# EAGLE design opac_c1 (EAGLE 6.3)

## Sheet 1 of 2
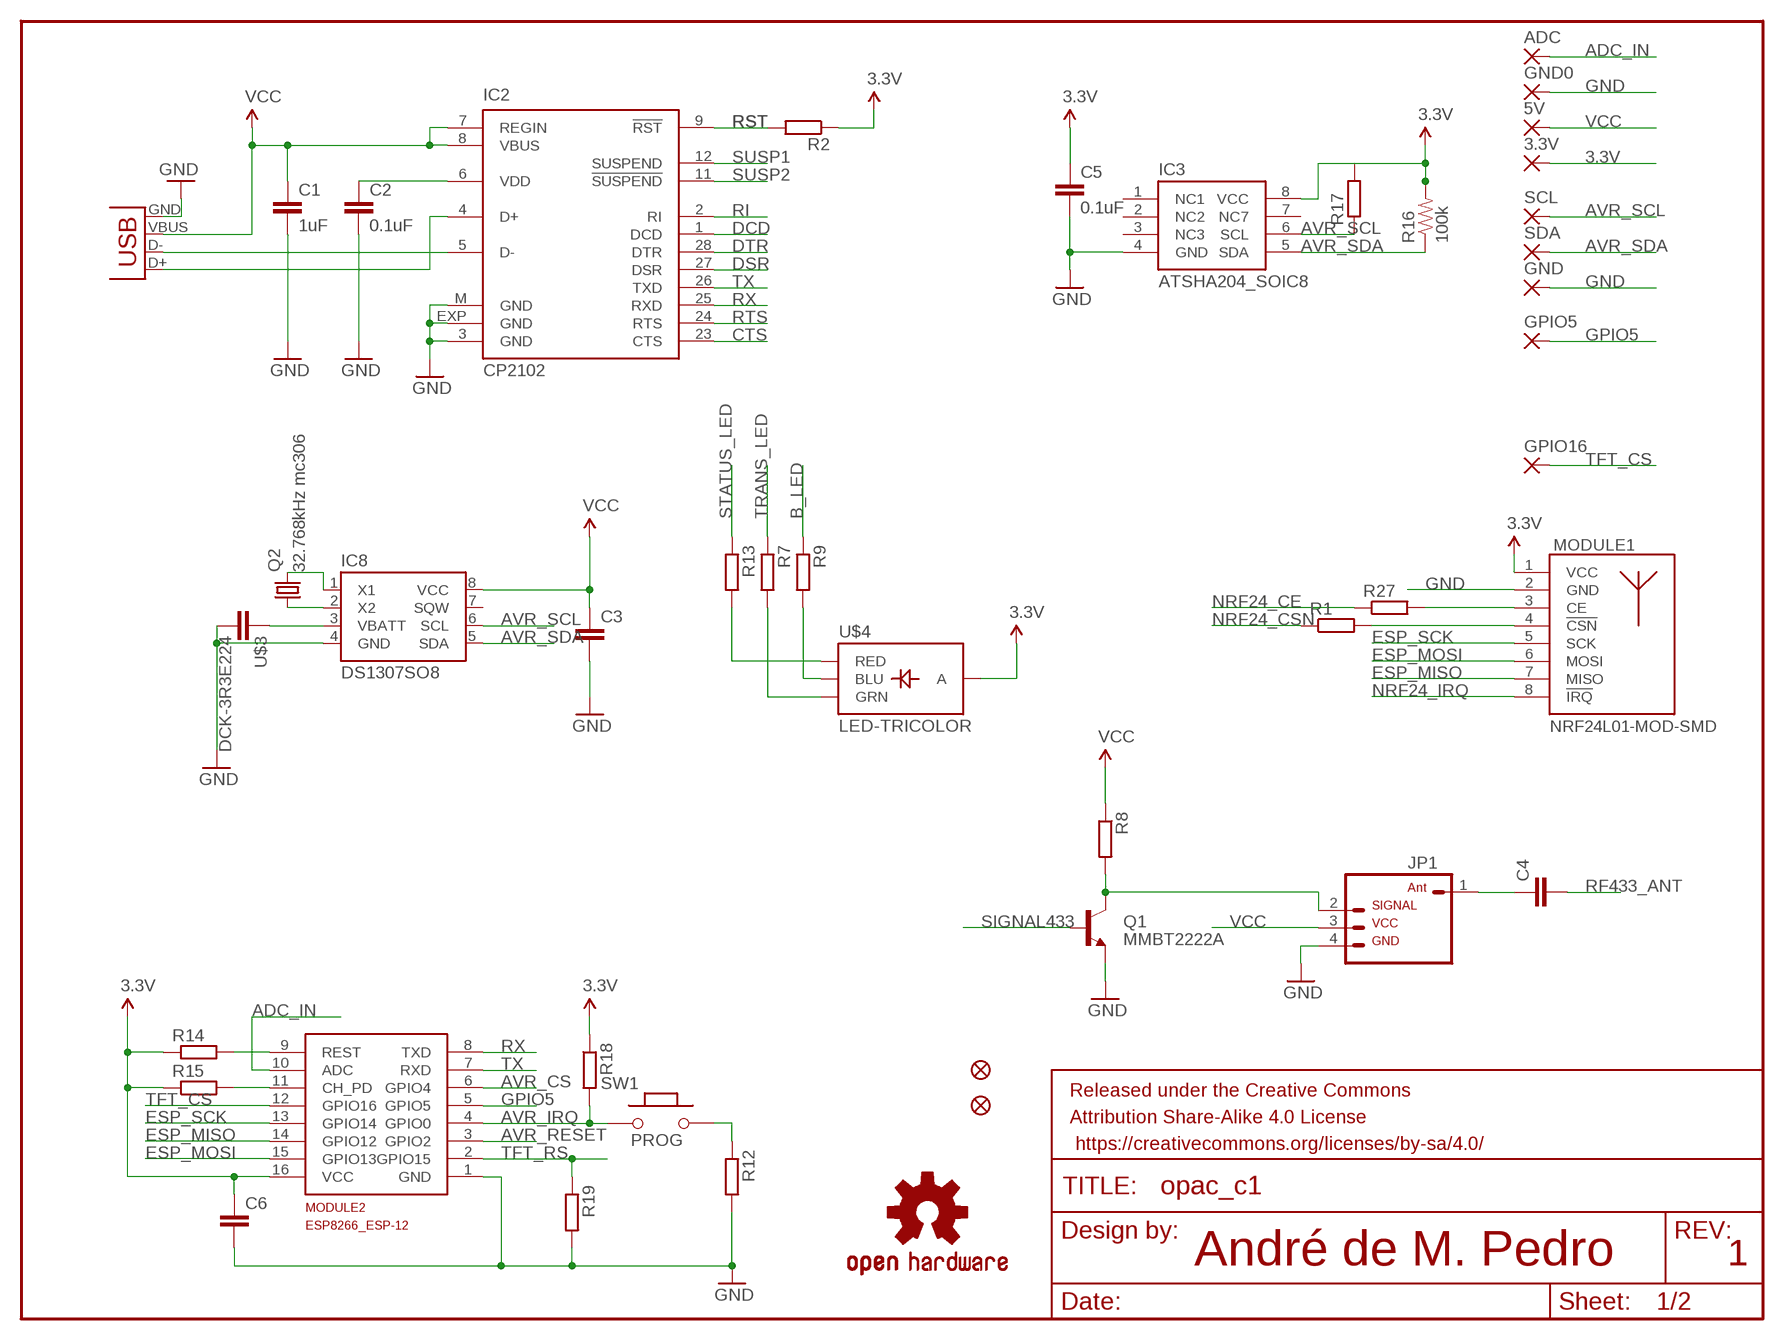
[diagram p0: schematic, sheet 1]

### Parts
3.3V  SMD2  [SMD1,27-2,54]
5V  SMD2  [SMD1,27-2,54]
ADC  SMD2  [SMD1,27-2,54]
C1  1uF  CAP0603  [0603]
C2  0.1uF  CAP0603  [0603]
C3  C-EUC0805K  [C0805K]
C4  C-EUC0603K  [C0603K]
C5  0.1uF  CAP0805  [0805]
C6  C-EUC0805K  [C0805K]
FRAME1  FRAME-LETTER  [CREATIVE_COMMONS]
GND  SMD2  [SMD1,27-2,54]
GND0  SMD2  [SMD1,27-2,54]
GPIO5  SMD2  [SMD1,27-2,54]
GPIO16  SMD2  [SMD1,27-2,54]
IC2  CP2102  CP210X_USB_UART  [MLP28]
IC3  ATSHA204_SOIC8  [SOIC8]
IC8  DS1307SO8  [SO08]
JP1  RF433SMD  [1X04-SMD]
JP2  FIDUCIAL1X2.5  [FIDUCIAL-1X2.5]
JP3  FIDUCIAL1X2.5  [FIDUCIAL-1X2.5]
LOGO1  OSHW-LOGOL  [OSHW-LOGO-L]
MODULE1  NRF24L01-MOD-SMD  [SMD8-MODULE]
MODULE2  ESP8266_ESP-12  [ESP8266-ESP12]
Q1  MMBT2222A  TRANSISTOR_NPNMMBT2222A  [SOT23-3]
Q2  32.768kHz mc306  MC-306  [MC-306]
R1  R-EU_R0805  [0805]
R2  R-EU_R0603  [R0603]
R7  R-EU_R0603  [R0603]
R8  R-EU_R0805  [0805]
R9  R-EU_R0603  [R0603]
R12  R-EU_R0805  [0805]
R13  R-EU_R0603  [R0603]
R14  R-EU_R0805  [0805]
R15  R-EU_R0805  [0805]
R16  100k  RESISTOR0805-RES  [0805]
R17  R-EU_R0805  [0805]
R18  R-EU_R0805  [0805]
R19  R-EU_R0805  [0805]
R27  R-EU_R0805  [0805]
SCL  SMD2  [SMD1,27-2,54]
SDA  SMD2  [SMD1,27-2,54]
SW1  PROG  PB157  [157SW]
U$3  DCK-3R3E224  [DCK-3R3E224]
U$4  LED-TRICOLOR  [LED-TRICOLOR-SMD]
USB1  USB-MICROB  [USB-MICROB]

### Nets
3.3V: 3.3V.1(P) C5.1 C6.1 IC3.8(VCC) MODULE1.1(VCC) MODULE2.16(VCC) R2.1 R14.1 R15.1 R16.2 R17.2 R18.1 U$4.A ; also sheet 2
ADC_IN: ADC.1(P) MODULE2.10(ADC)
AVR_CS: MODULE2.6(GPIO4) ; also sheet 2
AVR_IRQ: MODULE2.4(GPIO0) R18.2 SW1.1 ; also sheet 2
AVR_RESET: MODULE2.3(GPIO2) ; also sheet 2
AVR_SCL: IC3.6(SCL) IC8.6(SCL) R17.1 SCL.1(P) ; also sheet 2
AVR_SDA: IC3.5(SDA) IC8.5(SDA) R16.1 SDA.1(P) ; also sheet 2
B_LED: R9.1 ; also sheet 2
CTS: IC2.23(CTS)
DCD: IC2.1(DCD)
DSR: IC2.27(DSR)
DTR: IC2.28(DTR)
ESP_MISO: MODULE1.7(MISO) MODULE2.14(GPIO12) ; also sheet 2
ESP_MOSI: MODULE1.6(MOSI) MODULE2.15(GPIO13) ; also sheet 2
ESP_SCK: MODULE1.5(SCK) MODULE2.13(GPIO14) ; also sheet 2
GND: C1.2 C2.2 C3.2 C5.2 C6.2 GND0.1(P) GND.1(P) IC2.3(GND) IC2.EXP(GND) IC2.M(GND) IC3.4(GND) IC8.4(GND) JP1.4 MODULE1.2(GND) MODULE2.1(GND) Q1.2(E) R12.2 R19.2 U$3.P$1 USB1.GND ; also sheet 2
GPIO5: GPIO5.1(P) MODULE2.5(GPIO5)
N$1: IC8.3(VBATT) U$3.P$2
N$2: IC8.2(X2) Q2.1
N$3: MODULE1.4(!CSN) R1.2
N$4: C2.1 IC2.6(VDD)
N$5: IC8.1(X1) Q2.4
N$7: R13.2 U$4.R(RED)
N$11: R12.1 SW1.2
N$13: IC2.5(D-) USB1.D-
N$14: R7.2 U$4.G(GRN)
N$16: IC2.4(D+) USB1.D+
N$19: JP1.2 Q1.3(C) R8.2
N$20: R9.2 U$4.B(BLU)
N$23: MODULE1.3(CE) R27.2
N$26: C4.1 JP1.1
N$27: MODULE2.9(REST) R14.2
N$28: MODULE2.11(CH_PD) R15.2
NRF24_CE: R27.1 ; also sheet 2
NRF24_CSN: R1.1 ; also sheet 2
NRF24_IRQ: MODULE1.8(!IRQ) ; also sheet 2
RF433_ANT: C4.2
RI: IC2.2(RI)
RST: IC2.9(!RST) R2.2
RTS: IC2.24(RTS)
RX: IC2.25(RXD) MODULE2.8(TXD)
SIGNAL433: Q1.1(B) ; also sheet 2
STATUS_LED: R13.1 ; also sheet 2
SUSP1: IC2.12(SUSPEND)
SUSP2: IC2.11(!SUSPEND)
TFT_CS: GPIO16.1(P) MODULE2.12(GPIO16) ; also sheet 2
TFT_RS: MODULE2.2(GPIO15) R19.1 ; also sheet 2
TRANS_LED: R7.1 ; also sheet 2
TX: IC2.26(TXD) MODULE2.7(RXD)
VCC: 5V.1(P) C1.1 C3.1 IC2.7(REGIN) IC2.8(VBUS) IC8.8(VCC) JP1.3 R8.1 USB1.VBUS ; also sheet 2
Unconnected: IC3.1(NC1) IC3.2(NC2) IC3.3(NC3) IC3.7(NC7) IC8.7(SQW)

### Notes on the sheet
- André de M. Pedro | 1

## Sheet 2 of 2
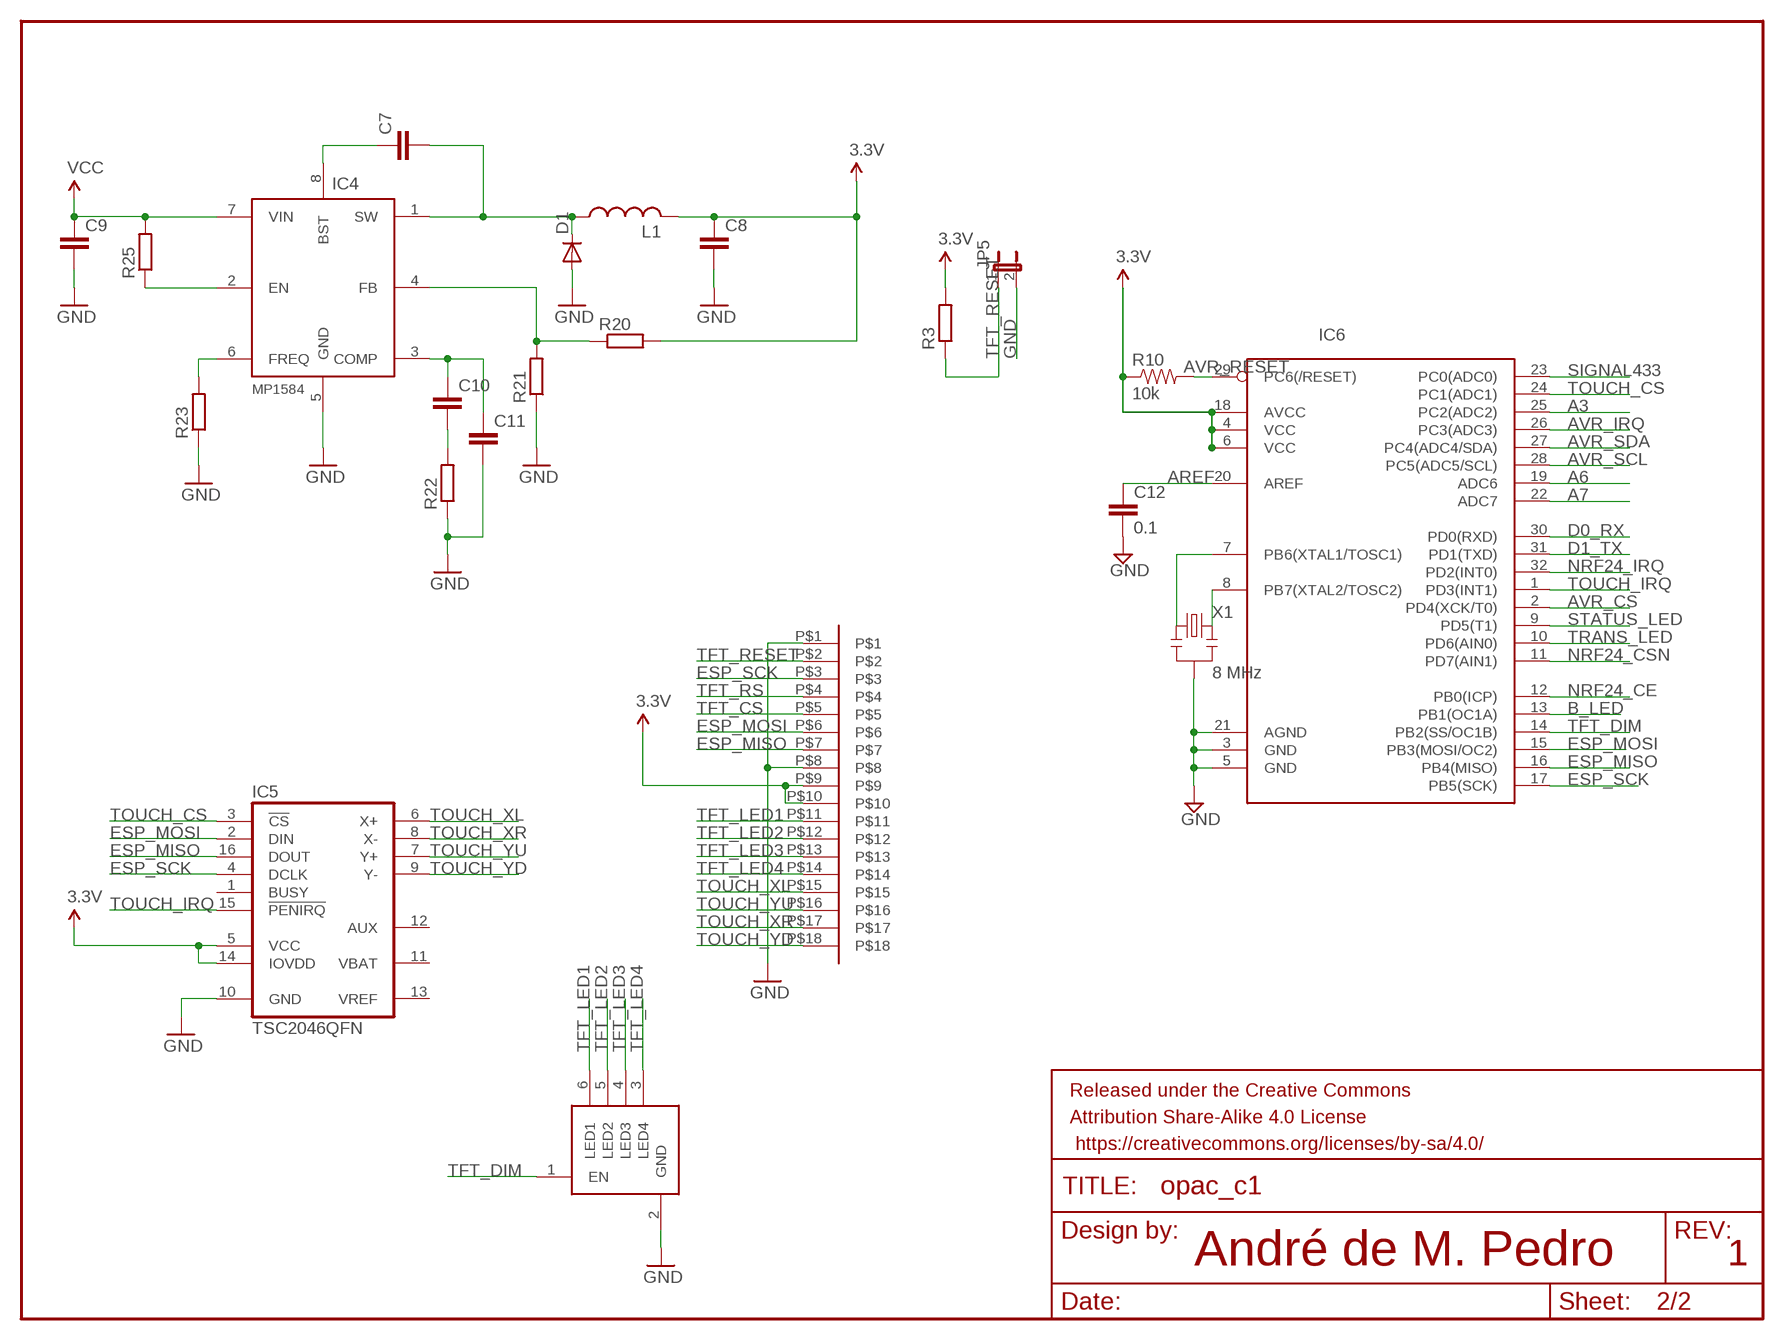
[diagram p1: schematic, sheet 2]

### Parts
C7  C-EUC0603  [C0603]
C8  C-EUC3216  [C3216]
C9  C-EUC3216  [C3216]
C10  C-EUC0603  [C0603]
C11  C-EUC0603  [C0603]
C12  0.1  CAP0603-CAP  [0603-CAP]
D1  DIODESMA  [SMA-DIODE]
FRAME2  FRAME-LETTER  [CREATIVE_COMMONS]
IC4  MP1584  [SO08-EPAD]
IC5  TSC2046QFN  [QFN16]
IC6  ATMega-328  ATMEGA168/328MLF  [MLF32]
IC7  RT9300  [SOT23-6]
JP5  JUMPER-2SMD-NO  [SJ_2S-NO]
L1  IHLP-2525CZ-01  [2525]
R3  R-EU_R0402  [R0402]
R10  10k  RESISTOR0603-RES  [0603-RES]
R20  R-EU_R0603  [R0603]
R21  R-EU_R0603  [R0603]
R22  R-EU_R0603  [R0603]
R23  R-EU_R0603  [R0603]
R25  R-EU_R0603  [R0603]
U$1  CONNECTOR8P0.8  [CONNECTOR18P0.8]
X1  8 MHz  RESONATORSMD  [RESONATOR-SMD]

### Nets
3.3V: C8.1 IC5.5(VCC) IC5.14(IOVDD) IC6.4(VCC) IC6.6(VCC) IC6.18(AVCC) L1.P$1 R3.2 R10.1 R20.2 U$1.P$9 U$1.P$10 ; also sheet 1
A3: IC6.25(PC2(ADC2))
A6: IC6.19(ADC6)
A7: IC6.22(ADC7)
AREF: C12.1 IC6.20(AREF)
AVR_CS: IC6.2(PD4(XCK/T0)) ; also sheet 1
AVR_IRQ: IC6.26(PC3(ADC3)) ; also sheet 1
AVR_RESET: IC6.29(PC6(/RESET)) R10.2 ; also sheet 1
AVR_SCL: IC6.28(PC5(ADC5/SCL)) ; also sheet 1
AVR_SDA: IC6.27(PC4(ADC4/SDA)) ; also sheet 1
B_LED: IC6.13(PB1(OC1A)) ; also sheet 1
D0_RX: IC6.30(PD0(RXD))
D1_TX: IC6.31(PD1(TXD))
ESP_MISO: IC5.16(DOUT) IC6.16(PB4(MISO)) U$1.P$7 ; also sheet 1
ESP_MOSI: IC5.2(DIN) IC6.15(PB3(MOSI/OC2)) U$1.P$6 ; also sheet 1
ESP_SCK: IC5.4(DCLK) IC6.17(PB5(SCK)) U$1.P$3 ; also sheet 1
GND: C8.2 C9.2 C11.2 C12.2 D1.A IC4.5(GND) IC5.10(GND) IC6.3(GND) IC6.5(GND) IC6.21(AGND) IC7.2(GND) JP5.2 R21.1 R22.1 R23.1 U$1.P$1 U$1.P$8 X1.2 ; also sheet 1
N$10: IC6.7(PB6(XTAL1/TOSC1)) X1.1
N$12: IC6.8(PB7(XTAL2/TOSC2)) X1.3
N$17: C7.2 D1.C IC4.1(SW) L1.P$2
N$18: C7.1 IC4.8(BST)
N$31: IC4.4(FB) R20.1 R21.2
N$32: IC4.2(EN) R25.1
N$33: IC4.6(FREQ) R23.2
N$34: C10.1 C11.1 IC4.3(COMP)
N$35: C10.2 R22.2
NRF24_CE: IC6.12(PB0(ICP)) ; also sheet 1
NRF24_CSN: IC6.11(PD7(AIN1)) ; also sheet 1
NRF24_IRQ: IC6.32(PD2(INT0)) ; also sheet 1
SIGNAL433: IC6.23(PC0(ADC0)) ; also sheet 1
STATUS_LED: IC6.9(PD5(T1)) ; also sheet 1
TFT_CS: U$1.P$5 ; also sheet 1
TFT_DIM: IC6.14(PB2(SS/OC1B)) IC7.1(EN)
TFT_LED1: IC7.6(LED1) U$1.P$11
TFT_LED2: IC7.5(LED2) U$1.P$12
TFT_LED3: IC7.4(LED3) U$1.P$13
TFT_LED4: IC7.3(LED4) U$1.P$14
TFT_RESET: JP5.1 R3.1 U$1.P$2
TFT_RS: U$1.P$4 ; also sheet 1
TOUCH_CS: IC5.3(!CS) IC6.24(PC1(ADC1))
TOUCH_IRQ: IC5.15(!PENIRQ) IC6.1(PD3(INT1))
TOUCH_XL: IC5.6(X+) U$1.P$15
TOUCH_XR: IC5.8(X-) U$1.P$17
TOUCH_YD: IC5.9(Y-) U$1.P$18
TOUCH_YU: IC5.7(Y+) U$1.P$16
TRANS_LED: IC6.10(PD6(AIN0)) ; also sheet 1
VCC: C9.1 IC4.7(VIN) R25.2 ; also sheet 1
Unconnected: IC5.1(BUSY) IC5.11(VBAT) IC5.12(AUX) IC5.13(VREF)

### Notes on the sheet
- André de M. Pedro | 1

## Library data of the parts
3.3V 5V ADC GND GND0 GPIO5 GPIO16 SCL SDA = wirepad:SMD2: SMD PAD
C1 C2 = SparkFun:CAP: Capacitor Standard 0603 ceramic capacitor, and 0.1" leaded capacitor.
C3 C4 C6-C11 = resistor:C-EU: CAPACITOR, European symbol
C5 = SparkFun-Passives:CAP: Capacitor Standard 0603 ceramic capacitor, and 0.1" leaded capacitor.
C12 = LowPowerLab:CAP: Capacitor Standard 0603 ceramic capacitor, and 0.1" leaded capacitor.
D1 = SparkFun:DIODE: Diode These are standard reverse protection diodes and small signal diodes. SMA package can handle up to about 1A. SOD-323 can handle about 200mA. What the SOD-323 package when ordering, there are some mfgs out there that are 5-pin packages.
FRAME1 FRAME2 = SparkFun-Aesthetics:FRAME-LETTER: Schematic Frame Standard 8.5x11 US Letter frame
IC2 = SparkFun:CP210X_USB_UART: Single-Chip USB to UART Bridge Source: www.silabs.com .. CP2101.pdf / cp2102.pdf. Spark Fun Electronics SKU : COM-00310
IC3 = SparkFun-DigitalIC:ATSHA204_SOIC8: ATSHA204; PROD_ID: IC-11981
IC4 = apedro_lib:MP1584
IC5 = TSC2046:TSC2046: ADS7846 Touch Screen Controller
IC6 = LowPowerLab:ATMEGA168/328: Atmel 32-pin 8-bit micro, 16k flash.
IC7 = apedro_lib:RT9300
IC8 = SparkFun:DS1307
JP1 = apedro_lib:RF433: Header 4 Standard 4-pin 0.1" header. Use with straight break away headers (SKU : PRT-00116), right angle break away headers (PRT-00553), swiss pins (PRT-00743), machine pins (PRT-00117), and female headers (PRT-00115). Molex polarized connector foot print use with SKU : PRT-08231 with associated crimp pins and housings.
JP2 JP3 = SparkFun:FIDUCIAL: Fiducial Alignment Points Various fiducial points for machine vision alignment.
JP5 = SparkFun:JUMPER-2: Jumper Basic 0.1" spaced jumper. Use with breakaway headers.
L1 = RNH_IHLP-2525CZ-01:IHLP-2525CZ-01
LOGO1 = SparkFun-Aesthetics:OSHW-LOGO: Open Source Hardware Logo This logo indicates the piece of hardware it is found on incorporates a OSHW license and/or adheres to the definition of open source hardware found here: http://freedomdefined.org/OSHW
MODULE1 = nrf24l01:NRF24L01-MOD: NRF24L01 based module VCC = 1.9~3.6V
MODULE2 = ESP8266-ESP12:ESP8266_ESP-12
Q1 = SparkFun-DiscreteSemi:TRANSISTOR_NPN: Generic NPN BJT MMBT2222A - TRANS-08049 (SOT-23, 1A 40V) MPSA42 - TRANS-09116 (SOT-23, 500mA 300V) MMBT5088LT1G - TRANS-11160 (SOT-23, 50 mA 30V) BC547 - COM-08928 <http://www.sparkfun.com/products/8928> (TO-92 45V 100mA) (1.Collector 2.Base 3.Emitter) 2N3904 - COM-00521 <http://www.sparkfun.com/products/521> (TO-92 40V 200mA) (1.Emitter 2.Base 3.Collector) P2N2222A - COM-12852 <http://www.sparkfun.com/products/12852> (TO-92 40V 600mA) (1.Collector 2.Base 3.Emitter); PROD_ID: TRANS-08049
Q2 = crystal:MC-306: kHz RANGE CRYSTAL UNIT SMD Source: MC-306_405_406_E07X.PDF Homepage <http://www.epsontoyocom.co.jp>; MPN: MC-306 60.0KHZ 100PPM ,12.5PF; OC_FARNELL: 1278040; OC_NEWARK: 31M5576
R1-R3 R7-R9 R12-R15 R17-R23 R25 R27 = resistor:R-EU_: RESISTOR, European symbol
R10 = LowPowerLab:RESISTOR: Resistor Basic schematic elements and footprints for 0603, 1206, and PTH resistors.
R16 = SparkFun-Passives:RESISTOR: Resistor Basic schematic elements and footprints for 0603, 1206, and PTH resistors.
SW1 = MySMD:PB157; PARTNO: RS 682-1421
U$1 = apedro_lib:CONNECTOR8P0.8
U$3 = apedro_lib:DCK-3R3E224
U$4 = SparkFun-LED:LED-TRICOLOR: Tri-Color LED SMD Proven layout and schematic for triple color LED in SMD package - common anode. Spark Fun Electronics SKU : COM-07844
USB1 = SparkFun:USB: USB Connectors USB-B-PTH is fully proven SKU : PRT-00139 USB-miniB is fully proven SKU : PRT-00587 USB-A-PCB is untested. USB-A-H is throughly reviewed, but untested. Spark Fun Electronics SKU : PRT-00437 USB-B-SMT is throughly reviewed, but untested. Needs silkscreen touching up. USB-A-S has not been used/tested USB-MB-H has not been used/tested
X1 = SparkFun:RESONATOR: Resonator Small SMD resonator. This is the itty bitty 10/20MHz resonators with built in caps. CSTCE10M0G55 and CSTCE20M0V53. Footprint has been reviewed closely but hasn't been tested yet.

## Board
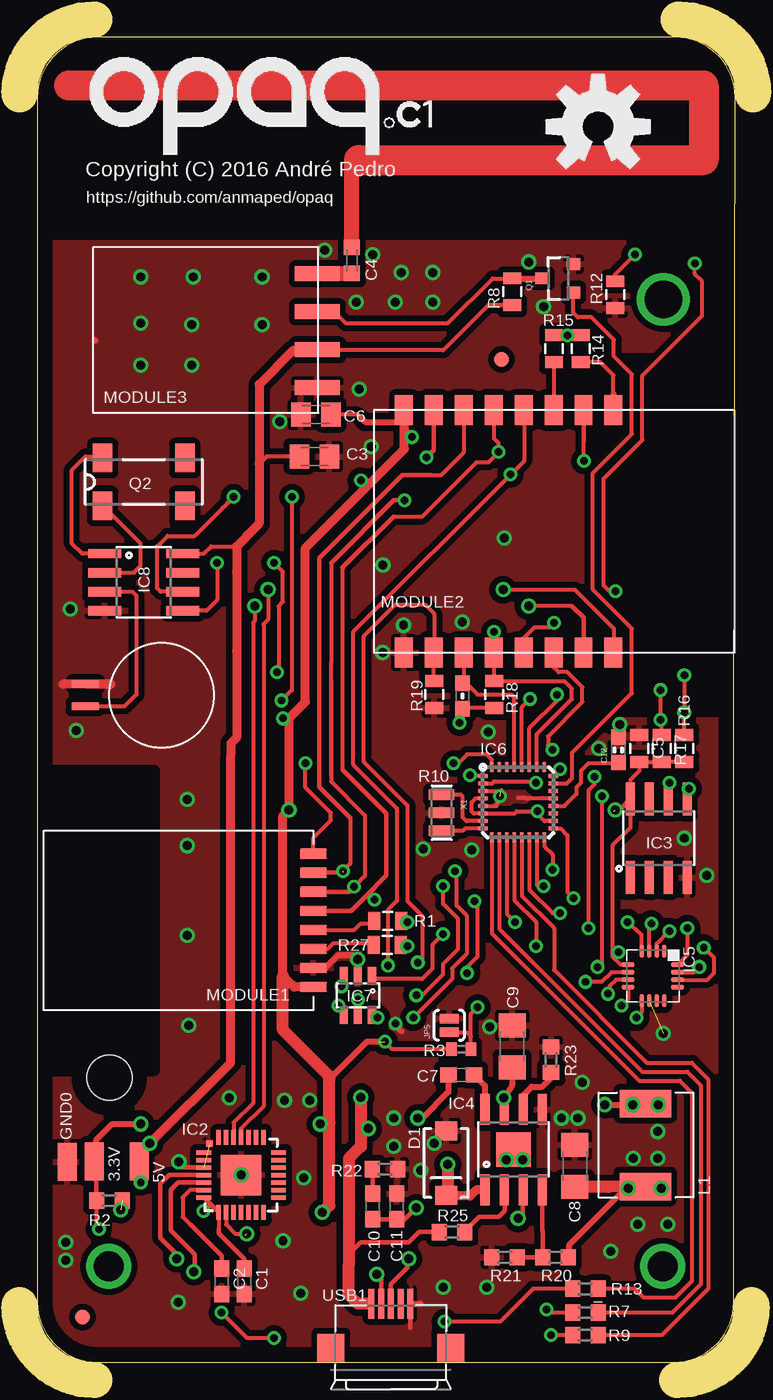
[diagram p2: board, top side]
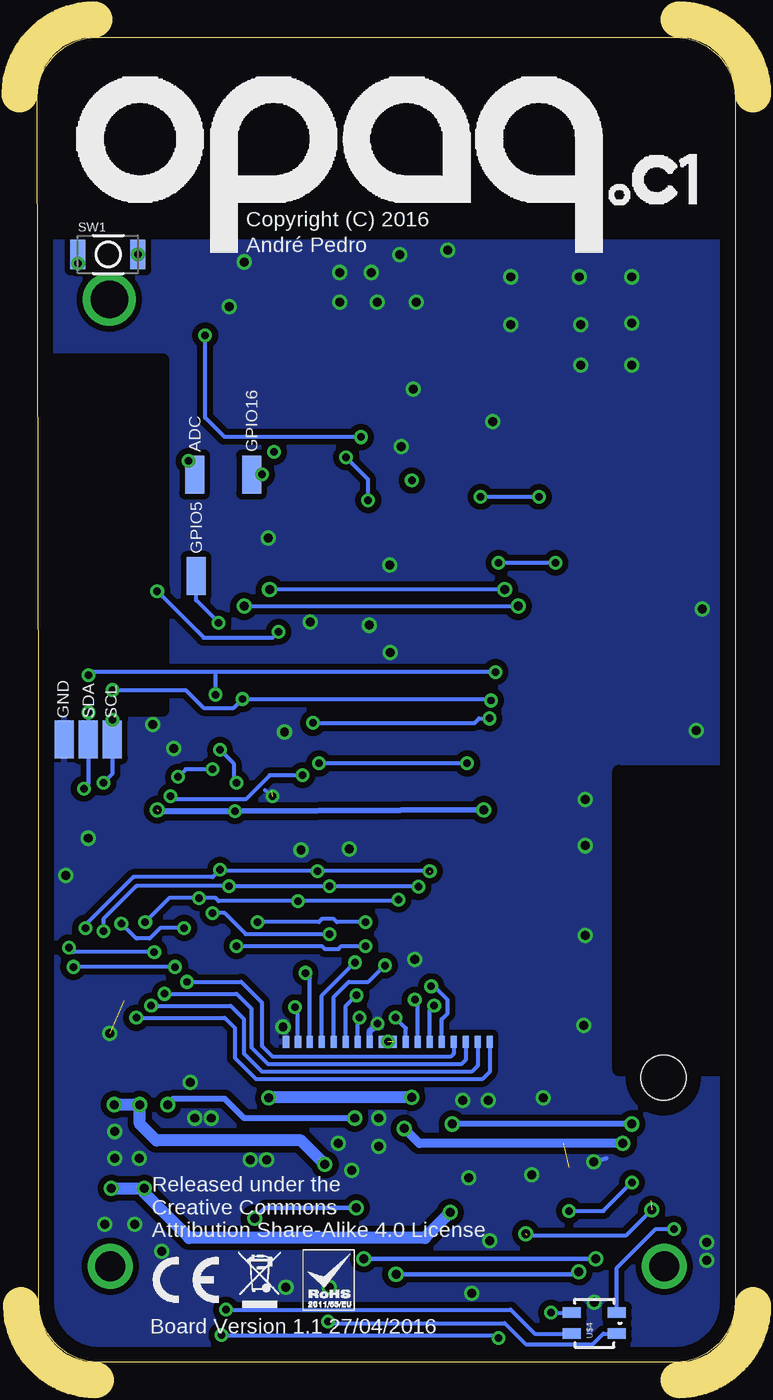
[diagram p3: board, bottom side, seen from below]

Size 46.6 x 88.5 mm. Coordinates in mm from the lower left corner, seen from the top.
Outline: 46.5,4 46.5,41.8 46.6,84.5 arc90 42.6,88.5 4,88.5 arc90 0,84.5 0,4 arc90 4,0 42.5,0 arc90 46.5,4
Copper layers (1*16): Top 0.035mm / dielectric 1.5mm / Bottom 0.035mm
Design rules "default *": minimum track width 10mil, minimum drill 5mil, track to track 7mil, track to pad 7mil, pad to pad 7mil, via to via 7mil, smd to smd 7mil, copper to edge 40mil, drill to drill 8mil, minimum pad ring 10mil, minimum via ring 8mil, stop-mask expansion 4mil, vias tented up to drill 0mil, thermal gap 10mil
Holes 3 mm at 4.8,19
tRestrict: area 0.1,75.4 to 46.5,88.5; area 0,19.5 to 7.8,39.5; area 38.2,43.5 to 46.5,67
bRestrict: area 38.2,43.5 to 46.5,67; area 0.1,75.4 to 46.5,88.5; area 0,19.5 to 7.8,39.5
Milling: 4 lines

### Footprints (pad centres in the part's own frame; a part is rotated, then mirrored left to right if it is on the bottom)
SMD1,27-2,54 = smd 1.27 x 2.54: 1 0,0
0603 = smd 1.1 x 1: 1 -0.85,0; 2 0.85,0
C0805K = smd 1.3 x 1.6: 1 -1,0; 2 1,0
C0603K = smd 1.05 x 1.08: 1 -0.875,0; 2 0.875,0
0805 = smd 0.8 x 1.2: 1 -0.9,0; 2 0.9,0
C0603 = smd 1.1 x 1: 1 -0.85,0; 2 0.85,0
C3216 = smd 1.6 x 1.8: 1 -1.4,0; 2 1.4,0
0603-CAP = smd 1.016 x 0.965: 1 -0.85,0; 2 0.85,0
SMA-DIODE = smd 1.27 x 1.47: A -2.15,0; C 2.15,0
MLP28 = smd 1 x 0.3: 1 -2.5,1.5; 2 -2.5,1; 3 -2.5,0.5; 4 -2.5,0; 5 -2.5,-0.5; 6 -2.5,-1; 7 -2.5,-1.5; 15 2.5,-1.5; 16 2.5,-1; 17 2.5,-0.5; 18 2.5,0; 19 2.5,0.5; 20 2.5,1; 21 2.5,1.5 | smd 0.3 x 1: 8 -1.5,-2.5; 9 -1,-2.5; 10 -0.5,-2.5; 11 0,-2.5; 12 0.5,-2.5; 13 1,-2.5; 14 1.5,-2.5; 22 1.5,2.5; 23 1,2.5; 24 0.5,2.5; 25 0,2.5; 26 -0.5,2.5; 27 -1,2.5; 28 -1.5,2.5 | smd 2.7 x 2.7: EXP 0,0 | smd 0.435 x 0.435: M -2.103,2.103
SOIC8 = smd 0.61 x 2.21: 1 -1.905,-2.616; 2 -0.635,-2.616; 3 0.635,-2.616; 4 1.905,-2.616; 5 1.905,2.616; 6 0.635,2.616; 7 -0.635,2.616; 8 -1.905,2.616
SO08-EPAD = smd 0.61 x 2.057: 1 -1.905,-2.692; 2 -0.635,-2.692; 3 0.635,-2.692; 4 1.905,-2.692; 5 1.905,2.692; 6 0.635,2.692; 7 -0.635,2.692; 8 -1.905,2.692 | smd 2.286 x 2.286: EPAD 0,0
QFN16 = smd 0.85 x 0.3: 1 -1.655,0.75; 2 -1.655,0.25; 3 -1.655,-0.25; 4 -1.655,-0.75; 9 1.655,-0.75; 10 1.655,-0.25; 11 1.655,0.25; 12 1.655,0.75 | smd 0.3 x 0.85: 5 -0.75,-1.655; 6 -0.25,-1.655; 7 0.25,-1.655; 8 0.75,-1.655; 13 0.75,1.655; 14 0.25,1.655; 15 -0.25,1.655; 16 -0.75,1.655
MLF32 = smd 0.7 x 0.3: 1 -2.35,1.75; 2 -2.35,1.25; 3 -2.35,0.75; 4 -2.35,0.25; 5 -2.35,-0.25; 6 -2.35,-0.75; 7 -2.35,-1.25; 8 -2.35,-1.75; 17 2.35,-1.75; 18 2.35,-1.25; 19 2.35,-0.75; 20 2.35,-0.25; 21 2.35,0.25; 22 2.35,0.75; 23 2.35,1.25; 24 2.35,1.75 | smd 0.3 x 0.7: 9 -1.75,-2.35; 10 -1.25,-2.35; 11 -0.75,-2.35; 12 -0.25,-2.35; 13 0.25,-2.35; 14 0.75,-2.35; 15 1.25,-2.35; 16 1.75,-2.35; 25 1.75,2.35; 26 1.25,2.35; 27 0.75,2.35; 28 0.25,2.35; 29 -0.25,2.35; 30 -0.75,2.35; 31 -1.25,2.35; 32 -1.75,2.35
SOT23-6 = smd 0.55 x 1.2: 1 -0.95,-1.3; 2 0,-1.3; 3 0.95,-1.3; 4 0.95,1.3; 5 0,1.3; 6 -0.95,1.3
SO08 = smd 0.61 x 2.21: 1 -1.905,-2.616; 2 -0.635,-2.616; 3 0.635,-2.616; 4 1.905,-2.616; 5 1.905,2.616; 6 0.635,2.616; 7 -0.635,2.616; 8 -1.905,2.616
1X04-SMD = smd 1 x 3: 1 -3.81,5; 2 -1.27,5; 3 1.27,5; 4 3.81,5
FIDUCIAL-1X2.5 = smd 1 x 1: 1 0,0
SJ_2S-NO = smd 0.635 x 1.27: 1 -0.45,0; 2 0.45,0
2525 = smd 1.829 x 3.429: P$1 2.769,0; P$2 -2.769,0
SMD8-MODULE = smd 0.7 x 1.8: 1 -4.445,0; 2 -3.175,0; 3 -1.905,0; 4 -0.635,0; 5 0.635,0; 6 1.905,0; 7 3.175,0; 8 4.445,0
ESP8266-ESP12 = smd 2 x 1.2: 1 16.2,2; 2 16.2,4; 3 16.2,6; 4 16.2,8; 5 16.2,10; 6 16.2,12; 7 16.2,14; 8 16.2,16; 9 0,16; 10 0,14; 11 0,12; 12 0,10; 13 0,8; 14 0,6; 15 0,4; 16 0,2
SOT23-3 = smd 0.8 x 0.9: 1 -0.95,-1; 2 0.95,-1; 3 0,1.1
MC-306 = smd 1.3 x 1.9: 1 -2.75,-1.6; 2 2.75,-1.6; 3 2.75,1.6; 4 -2.75,1.6
R0603 = smd 1 x 1.1: 1 -0.85,0; 2 0.85,0
R0402 = smd 0.7 x 0.9: 1 -0.65,0; 2 0.65,0
0603-RES = smd 1.016 x 0.965: 1 -0.85,0; 2 0.85,0
157SW = smd 1.016 x 1.981: 1 0,0; 2 4,0
CONNECTOR18P0.8 = smd 0.406 x 0.813: P$1 -6.8,0; P$2 -6,0; P$3 -5.2,0; P$4 -4.4,0; P$5 -3.6,0; P$6 -2.8,0; P$7 -2,0; P$8 -1.2,0; P$9 -0.4,0; P$10 0.4,0; P$11 1.2,0; P$12 2,0; P$13 2.8,0; P$14 3.6,0; P$15 4.4,0; P$16 5.2,0; P$17 6,0; P$18 6.8,0
DCK-3R3E224 = smd 0.5 x 1.8: P$1 -0.75,-5.1; P$2 0.75,-5.11
LED-TRICOLOR-SMD = smd 0.7 x 1.2: A 0.7,-1.5; B 0.7,1.5; G -0.7,1.5; R -0.7,-1.5
USB-MICROB = smd 0.4 x 2: D+ 0,3.1; D- -0.65,3.1; GND 1.3,3.1; ID 0.65,3.1; VBUS -1.3,3.1 | smd 1.8 x 1.9: GND@2 -4,0.15; GND@3 4,0.15
RESONATOR-SMD = smd 0.7 x 1.7: 1 -1.2,0; 2 0,0; 3 1.2,0

### Placement (x,y rotation side)
3.3V  3.8,13.4 0 top
5V  6.8,13.4 0 top
ADC  36.1,59.3 180 bottom
C1  13.8,5.4 270 top
C2  12.3,5.4 270 top
C3  18.5,60.5 0 top
C4  21,73.6 90 top
C5  40.2,41 90 top
C6  18.6,63.3 180 top
C7  28.3,19.2 180 top
C8  35.9,13.1 90 top
C9  31.7,21.1 90 top
C10  22.4,10.4 90 top
C11  24,10.4 90 top
C12  38.8,40.9 90 top
D1  27.3,13.3 270 top
FRAME1  -12.7,-17.7 0 top  (outside the outline)
FRAME2  -12.7,-17.7 0 top  (outside the outline)
GND  44.8,41.6 0 bottom
GND0  1.98,13.37 0 top
GPIO5  36,52.5 0 bottom
GPIO16  32.3,59.3 180 bottom
IC2  13.6,12.5 0 top
IC3  41.5,35 0 top
IC4  31.8,14.2 0 top
IC5  41.1,25.8 270 top
IC6  32.1,37.4 0 top
IC7  21.4,24.5 180 top
IC8  7.1,52.1 270 top
JP1  13.7,68.9 270 top
JP2  3,3 0 top
JP3  31,67 0 top
JP5  27.5,22.5 90 top
L1  40.6,14.5 270 top
LOGO1  37.44,82.53 0 top
MODULE1  18.43,29.51 90 top
MODULE2  22.47,63.6 270 top
Q1  34.8,72.4 90 top
Q2  7.1,58.8 0 top
R1  23.41,29.47 180 top
R2  4.8,10.8 0 top
R3  28.3,20.9 180 top
R7  36.6,3.3 180 top
R8  31.7,71.5 90 top
R9  36.6,1.8 180 top
R10  28.4,44.5 90 top
R12  38.6,71.3 270 top
R13  36.6,4.9 180 top
R14  36.3,67.7 270 top
R15  34.5,67.7 270 top
R16  43.2,41 270 top
R17  41.7,41 270 top
R18  30.5,44.6 90 top
R19  26.5,44.6 270 top
R20  34.6,7 0 top
R21  31.2,7 0 top
R22  23.2,12.9 180 top
R23  34.3,20.2 270 top
R25  27.7,8.7 180 top
R27  23.37,27.86 180 top
SCL  41.6,41.6 0 bottom
SDA  43.2,41.6 0 bottom
SW1  43.9,74 0 bottom
U$1  23.2,21.4 0 bottom
U$3  8.3,44.56 270 top
U$4  9.4,2.6 90 bottom
USB1  23.6,0.8 0 top
X1  27,36.7 270 top

### Tracks (layer width: path | path; a pad name or v marks a point on that pad's centre or on a via)
3.3V  (via drill 0.5, 0.6)  (2 unrouted)
  Top 0.254: MODULE2.16 24.5,63.57 24.5,62.3 v25,61.8 | IC6.4 29.25,37.65 29,37.4 29,36.8 29.15,36.65 IC6.6 31.85,36.65 32,36.8 v33.4,36.8 33.4,36.6 33.85,36.15 IC6.18 | v28.2,42.7 28.4,42.9 R10.1 28.45,43.7 R18.1 | 16.8,43 v16.4,43 | v21.6,58.9 22,58.5 | 21.7,63 21.4,63.3 C6.1 | R16.2 R17.2 C5.1 40.2,39.5 39.6,38.9 IC3.8 39.6,36.82 39.6,35.7 38.4,34.5 38.4,27.8 | 38.4,27.8 38.4,27.1 38.95,26.55 IC5.5 | 16.9,25.3 17,25.2 | 23.45,21.15 v23.2,21.4 23.7,20.9 R3.2 | IC5.14 44.75,25.55 45.2,26 45.2,27 v44.5,27.7 | v38.8,27.4 38.4,27.8 | v4.1,8.9 3.95,9.05 R2.1
  Top 0.305: R2.1 3.85,13.35 3.3V.1 | v38.6,36.9 38.88,36.9 IC3.8
  Top 0.406: R14.1 v35.4,68.6 R15.1 | 24.5,62.65 MODULE2.16 24.35,62.8 21.9,62.8 21.7,63 | 3.9,12.7 3.3V.1 3.9,13.5 3.9,14.8 5,15.9 v6.9,15.9 | v41.66,11.6 40.73,11.6 L1.P$1 | v39.46,11.6 39.3,11.6 35.5,7.8 35.5,7.05 R20.2 | v18.9,15.9 19.4,15.9 19.5,16 | v23.2,21.4 22,21.4 19.5,18.9
  Top 0.61: 24.5,62.65 24.5,62.3 24.5,61 22,58.5 17.9,54.4 17.9,44.1 16.8,43 v16.8,36.9 16.4,36.5 16.4,25.8 17,25.2 17.14,25.07 MODULE1.1
  Top 0.813: v19.03,9.99 19.5,10.46 19.5,16 19.5,18.9 19.5,19.1 16.4,22.2 16.4,25.8 | 35.9,11.4 C8.1 38.13,11.7 L1.P$1
  Bottom 0.254: v25,61.8 34.1,61.8 35.4,63.1 v35.4,68.6 | v28.2,42.7 17.4,42.7 17.1,43 v16.4,43 | v38.8,27.4 44.2,27.4 v44.5,27.7 | U$4.A 7.9,6.3 5.3,8.9 v4.1,8.9
  Bottom 0.406: v6.9,15.9 v18.9,15.9 | v16.8,36.9 v33.4,36.8 38.5,36.8 | U$1.P$9 v23.2,21.4
  Bottom 0.813: v19.03,9.99 20.72,8.3 36.46,8.3 39.46,11.3 v39.46,11.6 v41.66,11.6
ADC_IN  (via drill 0.5)
  Top 0.254: v36.5,60.2 36.5,61.54 36.47,61.57
  Top 0.305: 36.47,61.57 MODULE2.10
  Bottom 0.254: ADC.1 v36.5,60.2
AREF
  Top 0.254: C12.1 38.75,40 36.8,40 36.3,39.5 36.3,38.7 36,38.4 36,37.95 35.2,37.15 IC6.20
AVR_CS  (via drill 0.5)
  Top 0.254: MODULE2.6 34.5,47.37 34.5,46.4 34.8,46.1 35.4,46.1 36.4,45.1 36.4,44.1 34.1,41.8 34.1,41.2 v34.4,40.9 | v33.3,38.7 33.2,38.8 30.5,38.8 30.35,38.65 IC6.2
  Bottom 0.254: v33.3,38.7 33.5,38.9 33.5,40 v34.4,40.9
AVR_IRQ  (via drill 0.5)
  Top 0.254: IC6.26 33.35,41.95 35.7,44.3 35.7,45 35.2,45.5 R18.2 30.5,47.37 MODULE2.4 30.47,48.77 v30.5,48.8 | v38.6,51.5 38.2,51.5 37.8,51.9 37.8,59 40.4,61.6 40.4,65.9 44.4,69.9 44.4,72.2 43.9,72.7 v43.9,73.4
  Bottom 0.254: v38.6,51.5 35.5,48.4 30.9,48.4 v30.5,48.8 | v43.9,73.4 SW1.1
AVR_RESET
  Top 0.254: MODULE2.3 28.47,45.42 R10.2 28.45,45.3 28.7,45.3 29.4,44.6 31.65,44.6 31.85,44.4 | IC6.29 31.85,44.4 | 31.85,44.4 31.85,44.45
AVR_SCL  (via drill 0.5)
  Top 0.254: v41.6,44.9 v41.6,42.9 41.7,42.8 R17.1 | IC6.28 32.35,43.75 v32.9,44.3 | v17,57.8 17,44.9 v16.3,44.2 | v13.1,57.8 12.7,57.4 12.37,57.06 10.5,55.2 8.7,55.2 8,54.5 8,51.7 8.23,51.47 IC8.6 | IC3.6 42.13,38.63 v42.2,38.7
  Top 0.305: 42.2,36.75 IC3.6
  Bottom 0.254: v13.1,57.8 v17,57.8 | v41.6,44.9 36.7,44.9 35.5,43.7 33.5,43.7 v32.9,44.3 16.4,44.3 v16.3,44.2 | v41.6,42.9 SCL.1 41.6,39.3 v42.2,38.7
AVR_SDA  (via drill 0.5)  (1 unrouted)
  Top 0.254: IC3.5 43.41,38.2 | v43.2,45.9 v43.2,43.4 R16.1 | IC6.27 32.85,42.35 34.7,44.2 v34.7,44.6 | v16,46.1 16.1,46.2 16.1,50.5 16.4,50.8 16.4,52.8 v15.8,53.4 | v12,53.4 12,50.9 11.3,50.2 IC8.5
  Bottom 0.254: 43.4,38.2 v43.5,38.3 43.2,38.6 SDA.1 v43.2,43.4 | v16,46.1 34.7,46.1 | 34.7,46.1 43,46.1 v43.2,45.9 | v34.7,44.6 34.7,46.1 | v15.8,53.4 v12,53.4
B_LED
  Top 0.254: R9.1 41.7,1.8 44.8,4.9 44.8,18.9 43.7,20 40.7,20 34.5,26.2 34.5,29 32.35,31.15 IC6.13
ESP_MISO  (via drill 0.5)  (1 unrouted)
  Top 0.254: IC6.16 33.85,34.45 34.4,33.9 v34.4,32.9 | 20.9,36.36 20.9,33.3 v20.4,32.8 | MODULE2.14 28.47,60.77 26.97,59.27 26.27,59.27 | v43.4,29 43.4,27.2 IC5.16 | v27.9,32.8 28,32.7 28,30.5 28.7,29.8 28.7,27.3 27.7,26.3 27.7,25.6 v25.1,23
  Top 0.305: 20.9,36.36 18.82,38.44 18.82,53.72 24.37,59.27 26.27,59.27 | 18.45,32.7 20.4,32.7
  Top 0.406: 18.45,32.7 MODULE1.7
  Bottom 0.254: v20.4,32.8 v27.9,32.8 34.3,32.8 v34.4,32.9 | v34.4,32.9 34.5,32.8 | v43.4,29 43.4,29.2 40.2,32.4 34.9,32.4 v34.4,32.9 | U$1.P$7 25.2,22.8 v25.1,23
ESP_MOSI  (via drill 0.5)
  Top 0.254: 19.61,39.22 19.61,38.79 21.87,36.53 21.87,32.47 v21.15,31.75 20.82,31.41 | IC6.15 33.35,31.85 v33.8,31.8 | 19.61,53.39 19.61,46.71 19.6,46.7 19.61,46.69 19.61,45.5 | IC5.2 41.35,27.95 v42.2,28.8 | v27.1,31.8 27.1,30.6 28.1,29.6 28.1,27.6 27.1,26.6 27.1,25.9 25.7,24.5 v25.3,24.5
  Top 0.305: 24.05,57.58 v24.51,57.58 23.8,57.58 19.61,53.39 | MODULE2.15 26.47,60.93 v25.98,60.44 | 19.61,45.5 19.61,39.22 | MODULE1.6 20.82,31.41
  Bottom 0.254: v24.51,57.58 24.51,58.97 v25.98,60.44 | v27.1,31.8 v33.8,31.8 40,31.8 42.2,29.6 v42.2,28.8 42.2,29 | v27.1,31.8 21.2,31.8 v21.15,31.75 | v27.1,31.8 27.5,31.8 | U$1.P$6 26,23.8 v25.3,24.5
ESP_SCK  (via drill 0.5)
  Top 0.254: IC6.17 34.95,35.65 35.4,35.2 35.4,31.4 v35.8,31 | v22.5,30.9 22.2,30.9 21.95,31.15 | 20.39,39.55 20.4,39.56 20.4,53.04 20.36,53.08 | MODULE2.13 30.5,63.57 30.5,61.7 30.8,61.4 v30.8,60.8 30.1,60.1 29.3,60.1 25.7,56.5 23.79,56.5 | IC5.4 40.35,28.55 v39.4,29.4 | v28.7,26 28.7,26.4 29.4,27.1 29.4,30.6 v29.2,30.8
  Top 0.305: 20.36,53.08 23.79,56.5 | 20.39,39.55 23.3,36.65 23.3,32.5 21.95,31.15 20.95,30.14 MODULE1.5
  Bottom 0.254: v22.5,30.9 22.6,30.8 v29.2,30.8 34.5,30.8 34.7,31 v35.8,31 37.8,31 v39.4,29.4 | U$1.P$3 28.4,25.7 v28.7,26
GND  (via drill 0.5, 0.6)  (3 unrouted)
  Top 0.254: IC6.5 30.65,37.15 v30.9,37.8 | IC6.3 30.95,38.15 31,38.2 | IC6.21 32.65,37.65 32.6,37.7 32.1,37.7 | IC7.2 21.4,26.4 21,26.8 | 18.46,26.3 MODULE1.2
  Top 0.305: 24.9,3.8 24.9,2.3 | IC2.3 9.5,13 v9.45,13.37
  Top 0.406: USB1.GND 25.6,3.9 | 3.89,68.21 3.8,68.3 | 18.46,26.3 19.2,26.3 20.1,27.2 21.1,27.2 v21.4,26.9 | v23.9,22.6 23.9,22.5 24.3,22.1
  Top 0.61: U$3.P$1 4.89,45.31 4.9,45.3 1.7,45.3
  Bottom 0.254: v30.9,37.8 31.4,38.2
  Bottom 0.305: v9.45,13.37 8.6,13.6
  Bottom 0.406: U$1.P$8 24.4,22.1 v23.9,22.6
  other vias: 26.4,70.8 33.8,70.5 6.9,69.4 6.9,72.5 23.05,47.4 6.9,66.6 10,37.6 10.1,22.5 38.9,42.6 21.5,65 30.2,22.4 10.4,72.5 26.4,72.8 19.2,74.3 15,72.5 10.3,69.3 15,69.3 10.3,66.6 32.8,73.5 24.45,49.23 9.4,4 27.1,5 30,5 39.8,13.6 17.6,4.6 38.3,7.4 23.8,16.3 26.5,14.6 23.8,14.4 13.6,12.5 41.44,13.6 35,16.3 36.4,18.7 36.1,16.3 41.43,15.4 25.6,12.8 31.3,13.5 32.4,13.5 10,34.5 16.5,17.5 10,28.5 16.4,8.1 16.18,62.84 22.3,61.16 12.81,17.65 1.9,6.8 1.9,8 25.76,34.27 29,34.21 41.78,21.96 40.1,9.2 42.1,9.2 2.2,50.3 2.6,42.2 17.8,12.3 44.7,32.5 43.2,35 30.1,42.1 37.5,41 31.18,55.04 28.38,49.44 23.08,53.24 18.2,17.5 24.3,72.8 22.4,74 23.9,70.8 21.3,70.8
  pour Top (isolate 0.406): 0,88.5 46.5,88.5 46.5,0 0,0
  pour Bottom (isolate 0.406): 0,88.5 46.5,88.5 46.5,0 0,0
GPIO5  (via drill 0.5)
  Top 0.254: MODULE2.5 32.47,48.37 33.2,49.1 34.3,49.1 v34.5,49.4
  Bottom 0.254: v34.5,49.4 36,50.9 GPIO5.1
N$1
  Top 0.254: IC8.3 6.33,51.47 6.6,51.2 6.6,44.6 5.8,43.8 U$3.P$2
N$2
  Top 0.254: IC8.2 6.43,52.73 6.9,53.2 6.9,54.7 4.4,57.2 Q2.1
N$3
  Top 0.254: MODULE1.4 21.18,28.88 21.6,29.3 22.48,29.3 R1.2
N$4
  Top 0.254: IC2.6 10.2,11.5 9.7,11 9.7,9.7 10.2,9.2
  Top 0.305: 12.2,6.35 C2.1 12.3,7.1 10.2,9.2
N$5
  Top 0.254: IC8.1 3,54.01 2.3,54.7 2.3,59.6 3.2,60.5 4.25,60.5 Q2.4
N$7  (via drill 0.5)
  Top 0.254: R13.2 33.1,4.9 30.9,2.7 v27.2,2.7
  Bottom 0.254: v27.2,2.7 27.1,2.6 15.4,2.6 14,1.2 9.5,1.2 8.8,1.9 U$4.R
N$8  (via drill 2 pad 3)
  other vias: 4.75,6.4
N$9  (via drill 2 pad 3)
  other vias: 41.75,6.4
N$10
  Top 0.254: IC6.7 28.65,36.15 28.4,36.4 28.4,37.8 28.3,37.9 X1.1
N$11  (via drill 0.5)
  Top 0.254: R12.1 38.6,72.7 SW1.2
  Bottom 0.254: SW1.2 39.9,73.5
  other vias: 39.9,74
N$12
  Top 0.254: IC6.8 28.55,35.65 28.4,35.5 X1.3
N$13  (via drill 0.6)
  Top 0.305: USB1.D- 22.95,5.75 v22.65,5.87 | IC2.5 9.4,12 8.9,11.5 8.9,8.8 10.49,7.21 10.49,6.06 v10.45,6.02
  Bottom 0.305: v22.65,5.87 10.61,5.87 v10.45,6.02
N$14  (via drill 0.5)
  Top 0.254: R7.2 34.2,3.3 v34,3.5
  Bottom 0.254: v34,3.5 15,3.5 13.4,1.9 U$4.G
N$15  (via drill 2.5 pad 3)
  other vias: 41.8,71
N$16  (via drill 0.6)
  Top 0.305: USB1.D+ 23.6,5.2 24.7,6.3 24.7,6.8 v24.8,6.9 | IC2.4 8.8,12.5 8.2,11.9 8.2,8.3 9.3,7.2 v9.3,6.9
  Bottom 0.305: v24.8,6.9 v9.3,6.9
N$17  (via drill 0.6)
  Top 0.406: 27.34,11.11 D1.C | L1.P$2 40.53,17.2 v39.76,17.2 v37.9,17.2 | C7.2 27.45,18.05 25.7,16.3 v25.4,16.3
  Top 0.61: IC4.1 29.31,11.51 28.9,11.1 27.35,11.1 D1.C
  Top 0.813: v27.4,13.2 27.4,11.25 D1.C
  Bottom 0.406: v25.4,16.3 32.8,16.3 34.1,17.6 37.5,17.6 v37.9,17.2
  Bottom 0.813: v27.4,13.2 29,14.8 38.66,14.8 39.76,15.9 v39.76,17.2 v41.46,17.2
N$18
  Top 0.406: IC4.8 29.89,18.45 C7.1
N$19
  Top 0.254: R8.2 30.4,72.4 27.4,69.4 20.6,69.4 19.83,70.17 JP1.2
  Top 0.406: R8.2 Q1.3
N$20  (via drill 0.5)
  Top 0.254: R9.2 v34.3,1.8 | v15.8,1.6 14,1.6 v12.3,3.3
  Bottom 0.254: v34.3,1.8 16,1.8 v15.8,1.6 | v12.3,3.3 U$4.B
N$21
  Top 1: 21,74.5 21,80.2
N$23
  Top 0.254: 22.43,27.91 R27.2 22.33,28 19.8,28 19.41,27.61 MODULE1.3
N$26
  Top 0.813: JP1.1
  Top 1.016: C4.1 JP1.1
N$27
  Top 0.254: 38.47,64.68 38.47,65.93 37.6,66.8 R14.2
  Top 0.406: 38.47,64.68 MODULE2.9
N$28
  Top 0.254: MODULE2.11 34.5,63.63 R15.2
N$29
  Top 2: 2.1,85.3 44.5,85.3 44.5,80.3 21.49,80.3
N$31
  Top 0.305: IC4.4 33.7,11.1 33.7,8.8 33.75,8.75 R20.1 R21.2
N$32
  Top 0.305: R25.1 28.55,8.75 29.5,9.7 30.8,9.7 31.2,10.1 31.2,11.47 IC4.2
N$33
  Top 0.406: IC4.6 32.44,17.84 33,18.4 33.7,18.4 34.3,19 R23.2
N$34  (via drill 0.6)
  Top 0.305: IC4.3 32.4,11.47 32.4,9.9 v32.1,9.6 | v25.3,10.3 24.5,9.5 24.05,9.5 C11.1 C10.1
  Bottom 0.305: v25.3,10.3 25.31,10.31 31.38,10.31 v32.1,9.6
N$35
  Top 0.305: R22.2 22.4,12.9 C10.2
NRF24_CE  (via drill 0.5)
  Top 0.254: v24.7,27.8 24.5,27.8 R27.1 | IC6.12 31.85,30.85 33.3,29.4 v33.3,27.8 33.3,27.9
  Bottom 0.254: v33.3,27.8 27.6,27.8 27.4,27.6 26.5,27.6 26.3,27.8 v24.7,27.8
NRF24_CSN  (via drill 0.5)
  Top 0.254: IC6.11 31.35,29.95 v31.9,29.4 | v24.7,29.4 24.44,29.4 R1.1
  Bottom 0.254: v24.7,29.4 26.6,29.4 26.8,29.6 27.6,29.6 27.8,29.4 v31.9,29.4
NRF24_IRQ  (via drill 0.5)
  Top 0.254: MODULE1.8 18.43,35.03 19.6,36.2 19.6,36.7 17.9,38.4 v17.9,40 | IC6.32 30.35,40.25 30,40.6 28.7,40.6 28.1,40 v27.8,40
  Bottom 0.254: v17.9,40 v27.8,40
RST  (via drill 0.6)  (2 unrouted)
  Top 0.254: IC2.9 12.6,9.2 13.22,8.58 v13.98,8.58
  Top 0.305: IC2.9
  Bottom 0.254: 13.88,8.48 7.27,8.48 v5.57,10.18
RX  (via drill 0.6)
  Top 0.254: IC2.25 13.6,15.6 15.1,17.1 15.1,49.3 15.4,49.6 v15.4,51.6 | v31.1,51.6 35.9,51.6 38.5,49 38.5,47.43 MODULE2.8
  Top 0.305: MODULE2.8 38.47,47.43
  Bottom 0.254: v15.4,51.6 v31.1,51.6
SIGNAL433
  Top 0.254: IC6.23 35.35,38.65 35.7,39 35.7,40.7 39.7,44.7 39.7,49 37.1,51.6 37.1,59.4 39.7,62 39.7,66 38.5,67.2 38.5,68.3 37,69.8 36.1,69.8 35.8,70.1 Q1.1
STATUS_LED
  Top 0.254: 37.6,4.9 R13.1 39.9,4.9 40.5,4.3 42.6,4.3 43.7,5.4 43.7,18 42.9,18.8 40.2,18.8 30.35,28.65 IC6.9
TFT_CS  (via drill 0.5)
  Top 0.254: MODULE2.12 32.5,63.57 32.5,60.2 v31.6,59.3 21.1,48.8 21.1,39.9 24,37 24,30.8 23.4,30.2 v23.4,26.5
  Bottom 0.254: GPIO16.1 v31.6,59.3 | U$1.P$5 26.8,24.4 25.8,25.4 24.5,25.4 v23.4,26.5
TFT_DIM  (via drill 0.5)
  Top 0.254: IC6.14 32.85,31.55 34.4,30 v34.9,30 | v27.1,28.6 26.4,27.9 26.4,26.3 25.7,25.6 22.55,25.6 IC7.1
  Bottom 0.254: v27.1,28.6 32.7,28.6 34.1,30 v34.9,30
TFT_LED1  (via drill 0.5)
  Top 0.254: v22.7,23 22.55,23 IC7.6
  Bottom 0.254: U$1.P$11 22,22.3 v22.7,23
TFT_LED2  (via drill 0.5)
  Top 0.254: v21.4,24.2 IC7.5
  Bottom 0.254: U$1.P$12 21.2,24 v21.4,24.2
TFT_LED3  (via drill 0.5)
  Top 0.254: v20.1,23.8 20.1,23.55 IC7.4
  Bottom 0.254: U$1.P$13 20.4,23.5 v20.1,23.8
TFT_LED4  (via drill 0.5)
  Top 0.254: v20.3,25.1 20.45,25.35 IC7.3
  Bottom 0.254: U$1.P$14 19.6,22.9 19.2,23.3 19.2,24.2 20.1,25.1 v20.3,25.1
TFT_RESET  (via drill 0.5)
  Top 0.254: R3.1 28.95,21.75 | 28.95,21.75 28.7,22 27.55,22 JP5.1 | 28.95,21.75 28.95,23.25 v29.4,23.7
  Bottom 0.254: U$1.P$2 29.2,23.5 v29.4,23.7
TFT_RS  (via drill 0.5)
  Top 0.254: R19.1 26.47,45.53 MODULE2.2 26.5,47.43 26.5,50 25.9,50.6 23.9,50.6 21.8,48.5 21.8,40.1 24.7,37.2 24.7,30.8 25.7,29.8 25.7,27 v25.4,26.7
  Bottom 0.254: U$1.P$4 27.6,24.5 v25.4,26.7
TOUCH_CS  (via drill 0.5)
  Top 0.254: IC6.24 v34.9,39.6 | v37.2,39.1 37.2,38.6 36.8,38.2 v36.8,29 | IC5.3 40.85,28.95 v41,29.3
  Bottom 0.254: v34.9,39.6 36.7,39.6 v37.2,39.1 | v36.8,29 38.4,29 39.1,28.3 40,28.3 v41,29.3
TOUCH_IRQ  (via drill 0.5)
  Top 0.254: IC6.1 28.95,39.15 v28.9,39.2 | IC5.15 43.85,26.05 v44.2,26.4 | v37.7,37.8 37.7,26.7 v37.4,26.4
  Bottom 0.254: v28.9,39.2 31.1,39.2 32.7,37.6 37.5,37.6 v37.7,37.8 | v37.4,26.4 v44.2,26.4
TOUCH_XL  (via drill 0.5)
  Top 0.254: IC5.6 38.35,26.05 37.7,25.4 v36.6,25.4
  Bottom 0.254: v36.6,25.4 33,25.4 31.6,24 31.6,21.1 30.9,20.4 19,20.4 18.8,20.6 U$1.P$15
TOUCH_XR  (via drill 0.5)
  Top 0.254: IC5.8 39.45,24.25 v39,23.8
  Bottom 0.254: v39,23.8 33.7,23.8 32.8,22.9 32.8,20.6 31.6,19.4 17.6,19.4 17.2,19.8 U$1.P$17
TOUCH_YD  (via drill 0.5)
  Top 0.254: IC5.9 40.35,23.35 v40,23
  Bottom 0.254: v40,23 34.1,23 33.4,22.3 33.4,20.3 32,18.9 16.9,18.9 16.4,19.4 U$1.P$18
TOUCH_YU  (via drill 0.5)
  Top 0.254: IC5.7 38.65,25.55 38.2,25.1 38.2,24.7 v38.1,24.6
  Bottom 0.254: v38.1,24.6 33.3,24.6 32.3,23.6 32.3,21 31.2,19.9 18.3,19.9 18,20.2 U$1.P$16
TRANS_LED
  Top 0.254: R7.1 42.4,3.3 44.3,5.2 44.3,18.5 43.4,19.4 40.4,19.4 30.85,28.95 IC6.10
TX  (via drill 0.6)
  Top 0.254: IC2.26 13.1,16 14.4,17.3 14.4,49.4 14.5,49.5 v14.5,50.5 | 35.7,50.5 v32.8,50.5
  Top 0.305: 36.47,47.63 MODULE2.7 36.47,49.73 35.7,50.5
  Bottom 0.254: v32.8,50.5 v14.5,50.5
VCC  (via drill 0.5, 0.6)
  Top 0.254: IC2.8 12.1,8.9 | 13.2,52.7 13.3,52.8 | 13.25,47.55 13.3,47.5 | 11.7,10.4 11.4,10.4 v11.1,10.1 | v6.9,12 6.9,13.3 5V.1 | IC8.8 11.11,54.01 11.6,54.5 13.3,54.5 | C3.1 15.31,60.5 14.81,60 | 30.1,70.6 27.1,67.6 18.73,67.6 JP1.3
  Top 0.305: 20.8,6.5 20.6,6.5 | R25.2 25.5,8.7 24.8,8 21.6,8 20.8,7.2 | IC2.7 11.7,10.4 IC2.8 | 12.1,8.9 12.1,8.6 13.8,6.9 C1.1 | 30.1,70.6 R8.1
  Top 0.406: 5V.1 7.1,12.7 7.1,14.2 v7.5,14.6 | 31.2,16.53 IC4.7 31.16,17.96 v31.15,17.65 31.7,18.5 C9.1 | v22.1,15.6 21.9,15.6 21.6,15.9 | 14,55.23 14,55.2 | USB1.VBUS 22,3.9
  Top 0.61: v7.5,14.6 12.9,20 12.9,39.69 12.93,41.35 13.3,41.72 13.3,47.5 13.3,52.8 13.3,54.5 14,55.2 | 14,55.23 14.81,56.03 14.81,60 14.81,65.31 17.1,67.6 18.67,67.6 JP1.3
  Top 0.813: v21.6,17.7 21.6,15.9 21.6,14.4 20.8,13.6 20.8,7.2 20.8,6.5 20.8,4.5 21.4,3.9 22,3.9
  Bottom 0.254: v11.1,10.1 8.8,10.1 v6.9,12
  Bottom 0.61: v7.5,14.6 21.1,14.6 v22.1,15.6
  Bottom 0.813: v21.6,17.7 31.2,17.7 v31.15,17.65

### Text on the board
tPlace: Copyright (C) 2016 André Pedro | https://github.com/anmaped/opaq | MODULE3
bPlace: Copyright (C) 2016 | André Pedro | Released under the / Creative Commons / Attribution Share-Alike 4.0 License | Board Version 1.1 27/04/2016
tDocu: André Pedro